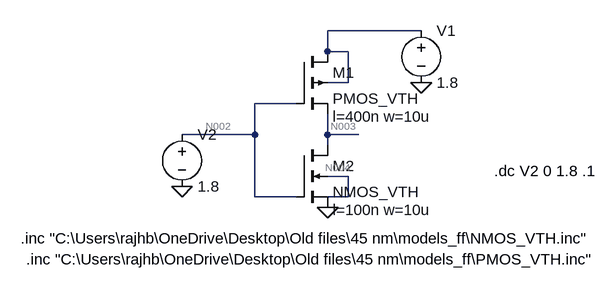
[diagram p0: schematic Exp3_NOT.asc]
Exp3_NOT.asc, the LTspice schematic file:
Version 4
SHEET 1 988 680
WIRE 384 48 240 48
WIRE 240 80 240 48
WIRE 272 80 240 80
WIRE 272 128 272 80
WIRE 272 128 240 128
WIRE 192 160 128 160
WIRE 128 208 128 160
WIRE 128 208 16 208
WIRE 240 208 240 176
WIRE 288 208 240 208
WIRE 240 224 240 208
WIRE 272 272 240 272
WIRE 128 304 128 208
WIRE 192 304 128 304
WIRE 272 304 272 272
WIRE 272 304 240 304
FLAG 240 320 0
FLAG 384 128 0
FLAG 16 288 0
SYMBOL pmos4 192 80 R0
WINDOW 123 56 100 Left 2
SYMATTR Value2 l=400n w=10u
SYMATTR InstName M1
SYMATTR Value PMOS_VTH
SYMBOL nmos4 192 224 R0
WINDOW 123 56 100 Left 2
SYMATTR Value2 l=100n w=10u
SYMATTR InstName M2
SYMATTR Value NMOS_VTH
SYMBOL voltage 384 32 R0
WINDOW 123 0 0 Left 0
WINDOW 39 0 0 Left 0
SYMATTR InstName V1
SYMATTR Value 1.8
SYMBOL voltage 16 192 R0
WINDOW 123 0 0 Left 0
WINDOW 39 0 0 Left 0
SYMATTR InstName V2
SYMATTR Value 1.8
TEXT -232 368 Left 2 !.inc "C:\\Users\\rajhb\\OneDrive\\Desktop\\Old files\\45 nm\\models_ff\\NMOS_VTH.inc"
TEXT -224 400 Left 2 !.inc "C:\\Users\\rajhb\\OneDrive\\Desktop\\Old files\\45 nm\\models_ff\\PMOS_VTH.inc"
TEXT 496 264 Left 2 !.dc V2 0 1.8 .1

The netlist it stands for:
* Exp3_NOT.asc
M1 N001 N002 N003 N001 PMOS_VTH l=400n w=10u
M2 N003 N002 0 N004 NMOS_VTH l=100n w=10u
V1 N001 0 1.8
V2 N002 0 1.8
.model NMOS NMOS
.model PMOS PMOS
.lib standard.mos
.inc "C:\Users\rajhb\OneDrive\Desktop\Old files\45 nm\models_ff\NMOS_VTH.inc"
.inc "C:\Users\rajhb\OneDrive\Desktop\Old files\45 nm\models_ff\PMOS_VTH.inc"
.dc V2 0 1.8 .1
.backanno
.end

* Results of the author's LTspice run, read from the files saved beside the schematic
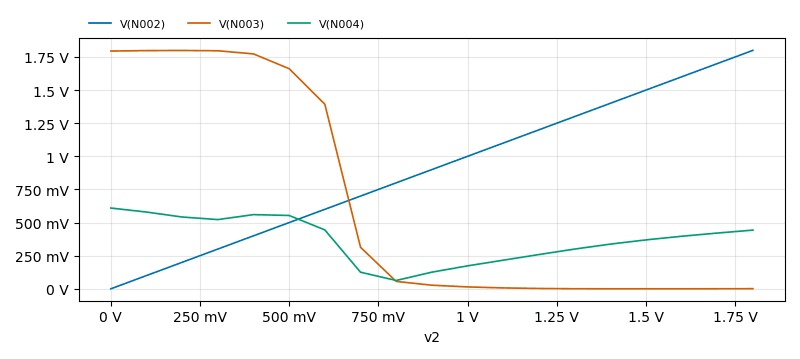
[diagram p1: DC transfer characteristic of Exp3_NOT.asc, plotted from the saved traces]
* DC transfer characteristic, 1 run:
*   V(N002): 0 V at v2=0 V, 1.8 V at v2=1.8 V, min 0 V, max 1.8 V
*   V(N003): 1.795 V at v2=0 V, 904.3 µV at v2=1.8 V, min 21.31 µV, max 1.799 V
*   V(N004): 609.7 mV at v2=0 V, 443 mV at v2=1.8 V, min 62.84 mV, max 609.7 mV